# EasyEDA schematic schematic.json
TITLE: Sheet_1; REV: 1.0; Date: 2025-03-04; Sheet: 1/1; Drawn By: danielh99915; Company: Your Company
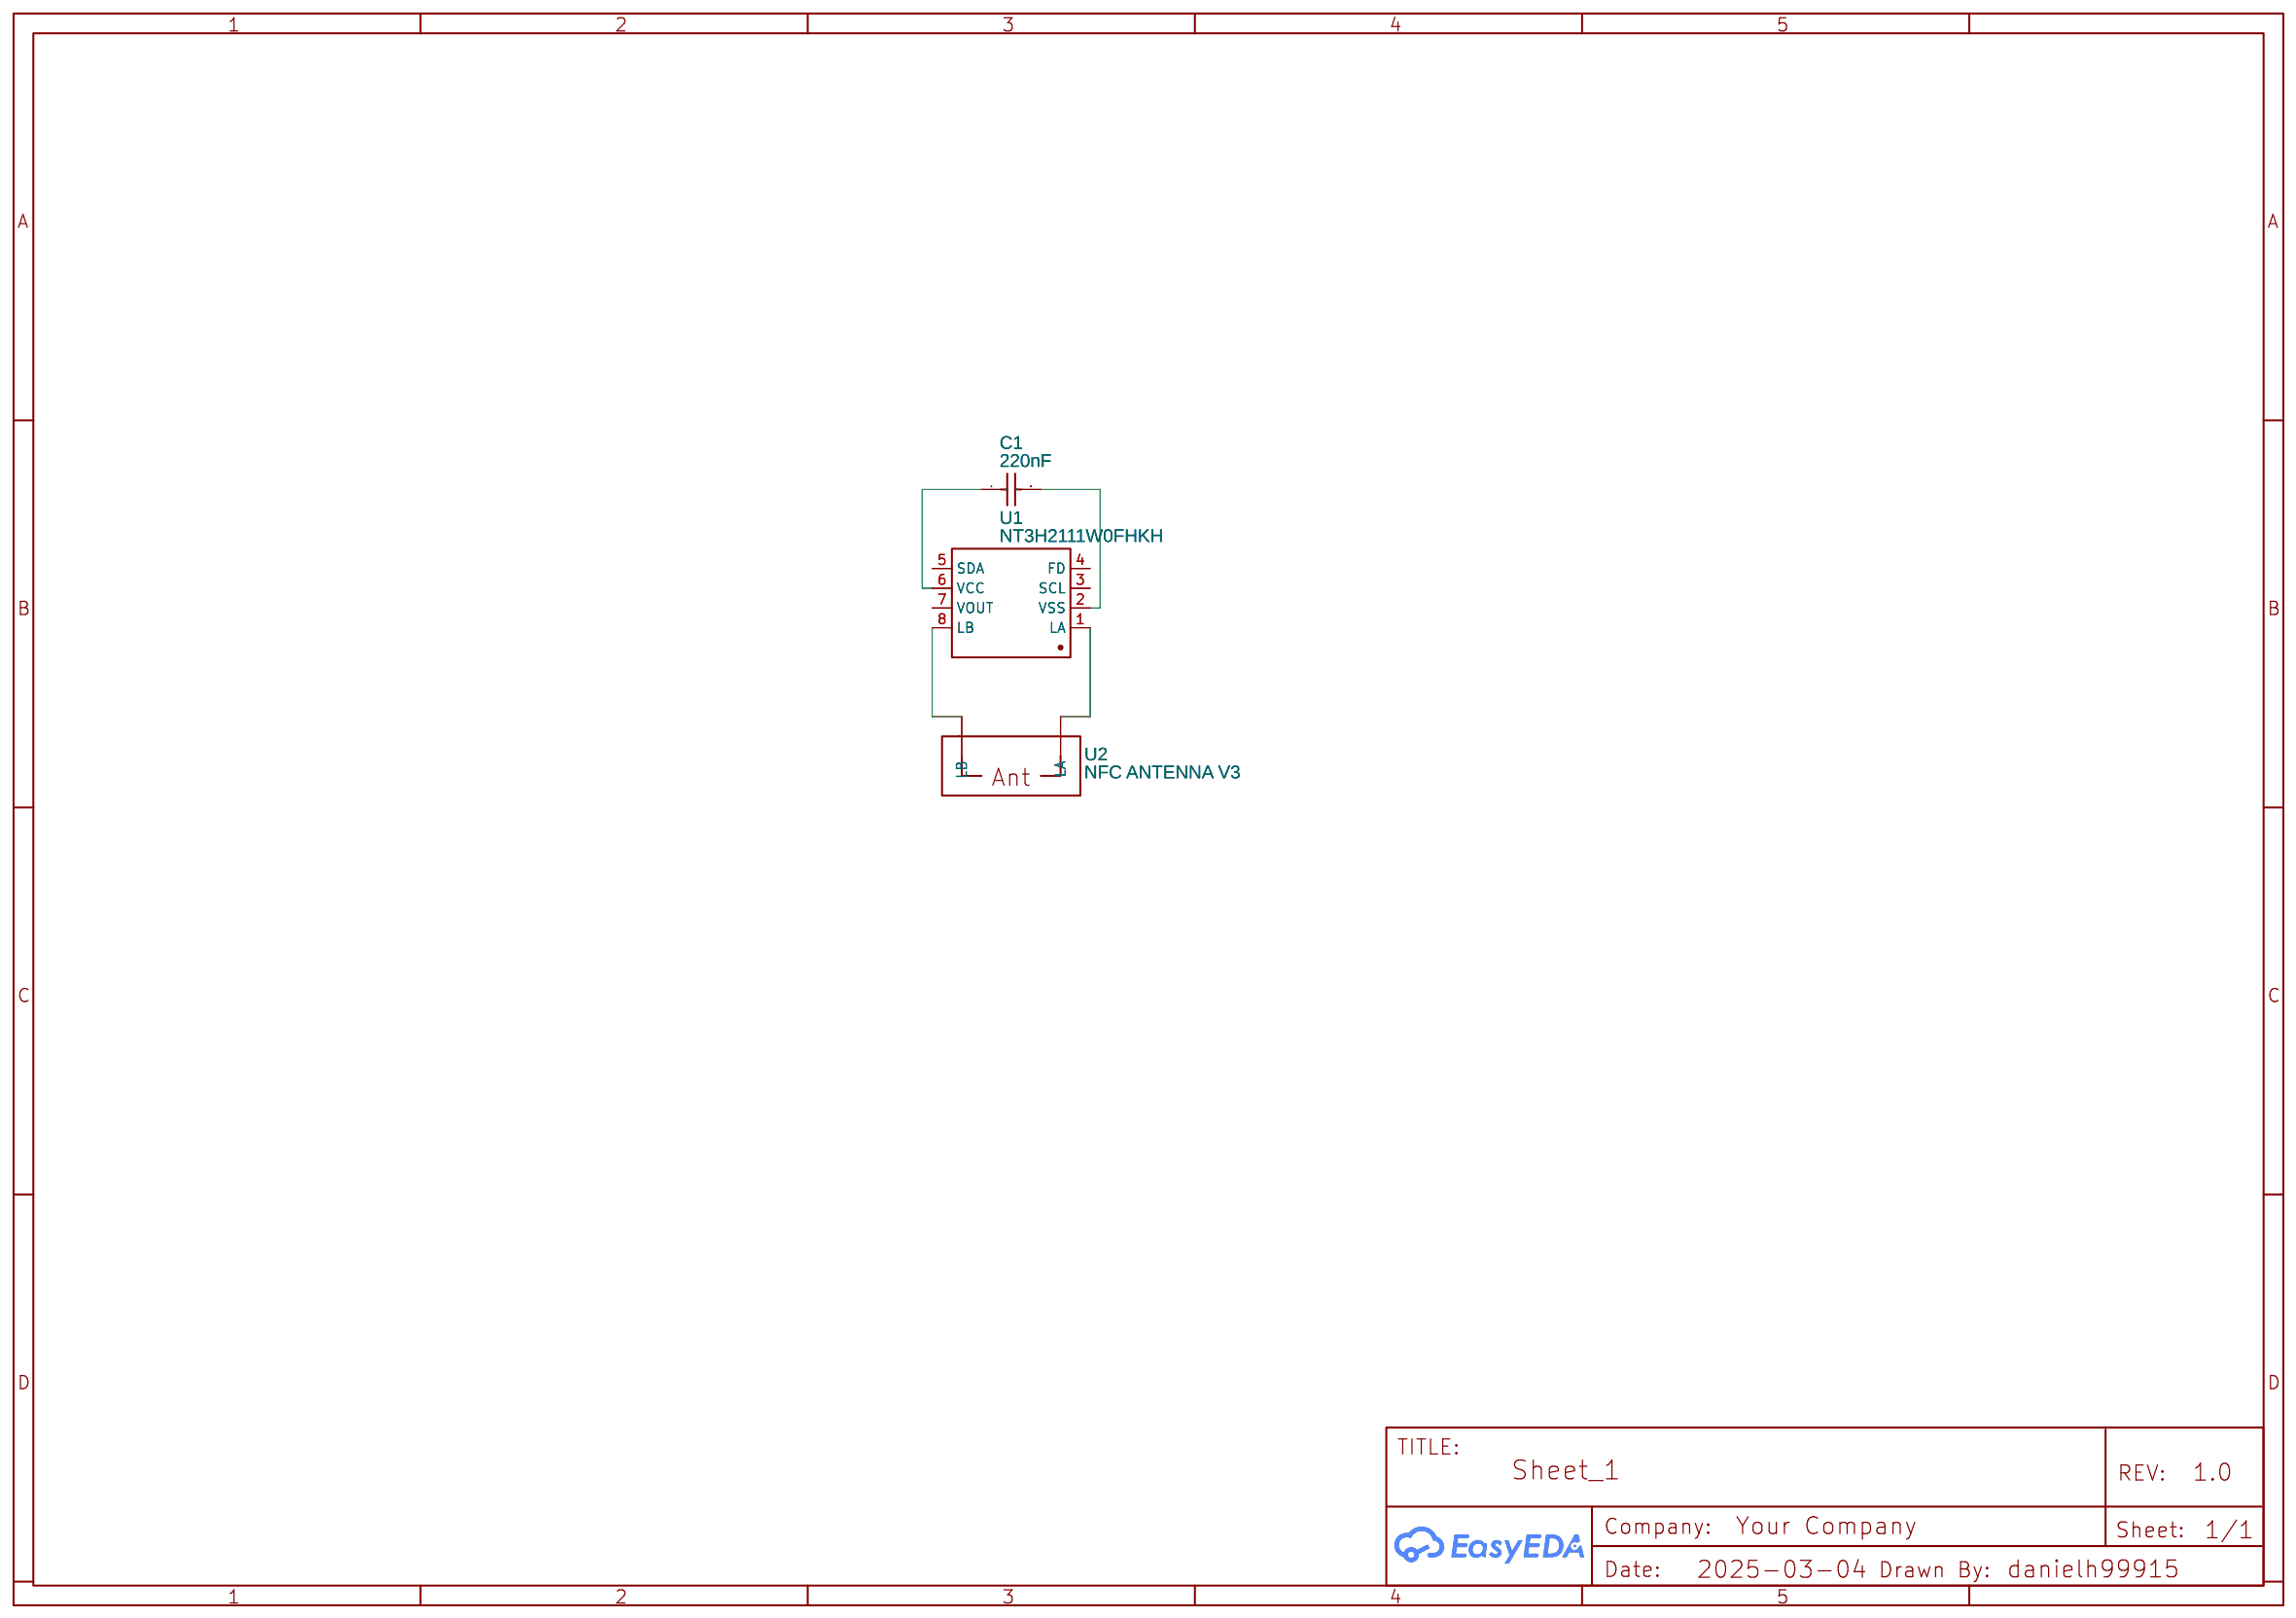
[diagram p0: schematic sheet]

## Parts
C1  220nF  [C0402]
U1  NT3H2111W0FHKH  [XQFN-8_L1.6-W1.6-P0.50-BL_NT3H2111W0FHKH]
U2  NFC ANTENNA V3  [NFC ANTENNA V3]

## Library data of the parts
C1 = C1005X5R0J224KT000F: Supplier: LCSC; Manufacturer: TDK; Supplier Part: C76593; JLCPCB Part Class: Extended Part
U1 = NT3H2111W0FHKH: Contributor: LCSC; Supplier: LCSC; Supplier Part: C710403; Manufacturer: NXP(恩智浦); JLCPCB Part Class: Extended Part
U2 = NFC ANTENNA V3: Contributor: MarvinVoetmann

## Nets
Net-(C1-1): C1.1 U1.6(VCC)
Net-(C1-2): C1.2 U1.2(VSS)
Net-(U1-1): U1.1(LA) U2.LA
Net-(U1-8): U1.8(LB) U2.LB

Not connected (* = marked no-connect by the designer): U1 3(SCL) 4(FD) 5(SDA) 7(VOUT)
